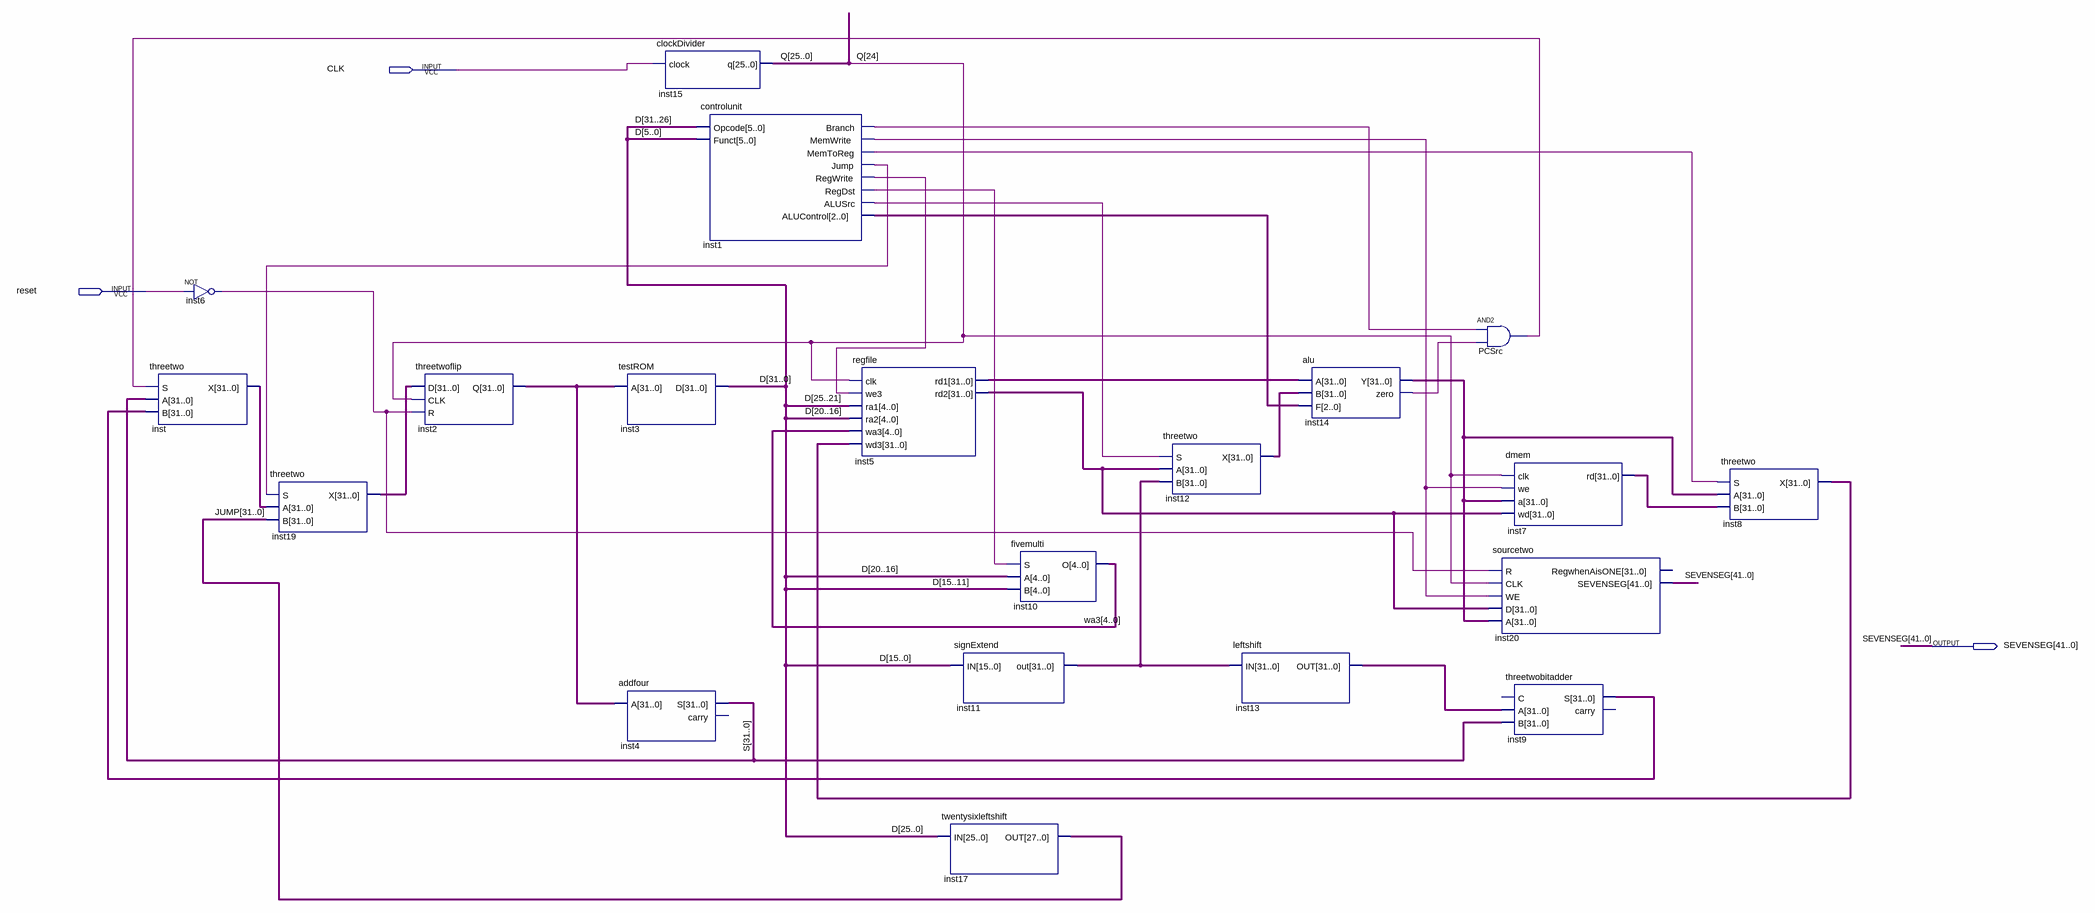
[diagram p0: schematic sheet]
// Quartus schematic processor3.bdf as structural Verilog: 20 symbols, 3 pins
module processor3 (
  input  CLK,
  input  reset,
  output [41:0] SEVENSEG
);

  wire inst1_alusrc, inst1_branch, inst1_jump, inst1_memtoreg, inst1_memwrite, inst1_regdst, inst1_regwrite,
       inst6_out, inst14_zero, PCSrc_out;
  wire [2:0] inst1_alucontrol;
  wire [4:0] wa3;
  wire [25:0] Q;
  wire [31:0] D, inst2_q, inst5_rd1, inst5_rd2, inst7_rd, inst8_x, inst9_s, inst11_out, inst12_x, inst13_out,
       inst14_y, inst19_x, inst_x, JUMP, S;

  threetwo inst (.S(PCSrc_out), .A(S), .B(inst9_s), .X(inst_x));
  not inst6 (inst6_out, reset);
  threetwo inst19 (.S(inst1_jump), .A(inst_x), .B(JUMP), .X(inst19_x));
  threetwoflip inst2 (.D(inst19_x), .CLK(Q[24]), .R(inst6_out), .Q(inst2_q));
  clockDivider inst15 (.clock(CLK), .q(Q));
  testROM inst3 (.A(inst2_q), .D(D));
  addfour inst4 (.A(inst2_q), .S(S));  // open: carry
  controlunit inst1 (
    .Opcode(D[31:26]), .Funct(D[5:0]), .Branch(inst1_branch), .MemWrite(inst1_memwrite),
    .MemToReg(inst1_memtoreg), .Jump(inst1_jump), .RegWrite(inst1_regwrite), .RegDst(inst1_regdst),
    .ALUSrc(inst1_alusrc), .ALUControl(inst1_alucontrol));
  regfile inst5 (
    .clk(Q[24]), .we3(inst1_regwrite), .ra1(D[25:21]), .ra2(D[20:16]), .wa3(wa3), .wd3(inst8_x),
    .rd1(inst5_rd1), .rd2(inst5_rd2));
  signExtend inst11 (.IN(D[15:0]), .out(inst11_out));
  twentysixleftshift inst17 (.IN(D[25:0]), .OUT(JUMP));
  fivemulti inst10 (.S(inst1_regdst), .A(D[20:16]), .B(D[15:11]), .O(wa3));
  threetwo inst12 (.S(inst1_alusrc), .A(inst5_rd2), .B(inst11_out), .X(inst12_x));
  leftshift inst13 (.IN(inst11_out), .OUT(inst13_out));
  alu inst14 (.A(inst5_rd1), .B(inst12_x), .F(inst1_alucontrol), .Y(inst14_y), .zero(inst14_zero));
  and PCSrc (PCSrc_out, inst1_branch, inst14_zero);
  dmem inst7 (.clk(Q[24]), .we(inst1_memwrite), .a(inst14_y), .wd(inst5_rd2), .rd(inst7_rd));
  sourcetwo inst20 (
    .R(inst6_out), .CLK(Q[24]), .WE(inst1_memwrite), .D(inst5_rd2), .A(inst14_y), .SEVENSEG(SEVENSEG));  // open: RegwhenAisONE
  threetwobitadder inst9 (.A(inst13_out), .B(S), .S(inst9_s));  // open: C, carry
  threetwo inst8 (.S(inst1_memtoreg), .A(inst14_y), .B(inst7_rd), .X(inst8_x));
endmodule
